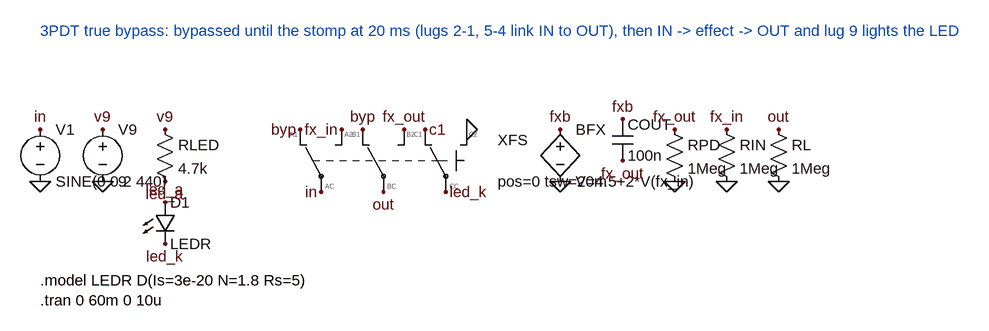
[diagram p0: schematic demo_switch.asc]
demo_switch.asc, the LTspice schematic file:
Version 4
SHEET 1 1300 480
FLAG 0 112 in
FLAG 0 192 0
FLAG 96 112 v9
FLAG 96 192 0
FLAG 192 112 v9
FLAG 192 192 led_a
FLAG 192 224 led_a
FLAG 192 288 led_k
FLAG 400 112 byp
FLAG 432 208 in
FLAG 464 112 fx_in
FLAG 496 112 byp
FLAG 528 208 out
FLAG 560 112 fx_out
FLAG 592 112 c1
FLAG 624 208 led_k
FLAG 656 112 0
FLAG 800 112 fxb
FLAG 800 192 0
FLAG 896 96 fxb
FLAG 896 160 fx_out
FLAG 976 112 fx_out
FLAG 976 192 0
FLAG 1056 112 fx_in
FLAG 1056 192 0
FLAG 1136 112 out
FLAG 1136 192 0
SYMBOL voltage 0 96 R0
SYMATTR InstName V1
SYMATTR Value SINE(0 0.2 440)
SYMBOL voltage 96 96 R0
SYMATTR InstName V9
SYMATTR Value 9
SYMBOL res 176 96 R0
SYMATTR InstName RLED
SYMATTR Value 4.7k
SYMBOL LED 176 224 R0
SYMATTR InstName D1
SYMATTR Value LEDR
SYMBOL sw_3pdt 400 96 R0
SYMATTR InstName XFS
SYMATTR Value pos=0 tsw=20m
SYMBOL bv 800 96 R0
SYMATTR InstName BFX
SYMATTR Value V=4.5+2*V(fx_in)
SYMBOL cap 880 96 R0
SYMATTR InstName COUT
SYMATTR Value 100n
SYMBOL res 960 96 R0
SYMATTR InstName RPD
SYMATTR Value 1Meg
SYMBOL res 1040 96 R0
SYMATTR InstName RIN
SYMATTR Value 1Meg
SYMBOL res 1120 96 R0
SYMATTR InstName RL
SYMATTR Value 1Meg
TEXT 0 344 Left 2 !.model LEDR D(Is=3e-20 N=1.8 Rs=5)\n.tran 0 60m 0 10u
TEXT 0 -40 Left 2 ;3PDT true bypass: bypassed until the stomp at 20 ms (lugs 2-1, 5-4 link IN to OUT), then IN -> effect -> OUT and lug 9 lights the LED

The netlist it stands for:
* demo_switch.asc
V1 in 0 SINE(0 0.2 440)
V9 v9 0 9
RLED v9 led_a 4.7k
D1 led_a led_k LEDR
XXFS byp in fx_in byp out fx_out c1 led_k 0 sw_3pdt pos=0 tsw=20m  ; pins A1 AC A2 B1 BC B2 C1 CC C2
BFX fxb 0 V=4.5+2*V(fx_in)
COUT fxb fx_out 100n
RPD fx_out 0 1Meg
RIN fx_in 0 1Meg
RL out 0 1Meg
.model D D
.lib standard.dio
.model LEDR D(Is=3e-20 N=1.8 Rs=5)
.tran 0 60m 0 10u
* 3PDT true bypass: bypassed until the stomp at 20 ms (lugs 2-1, 5-4 link IN to OUT), then IN -> effect -> OUT and lug 9 lights the LED
.lib switch.sub
.backanno
.end